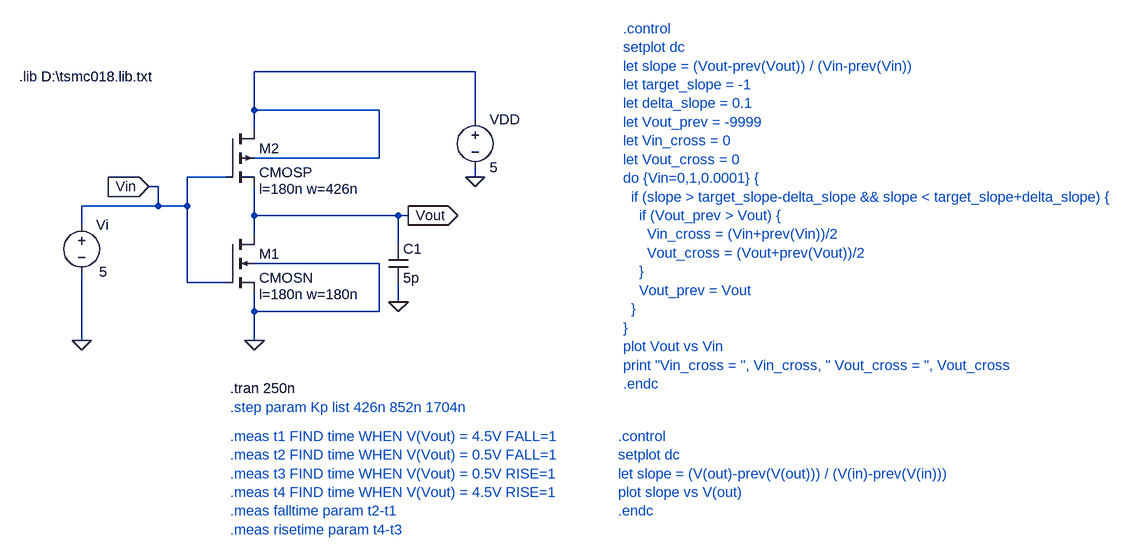
[diagram p0: schematic Project.asc]
Project.asc, the LTspice schematic file:
Version 4
SHEET 1 4604 1200
WIRE 976 128 608 128
WIRE 608 192 608 128
WIRE 816 192 608 192
WIRE 976 208 976 128
WIRE 608 224 608 192
WIRE 816 272 816 192
WIRE 816 272 608 272
WIRE 560 304 496 304
WIRE 976 304 976 288
WIRE 448 320 432 320
WIRE 448 352 448 320
WIRE 448 352 320 352
WIRE 496 352 496 304
WIRE 496 352 448 352
WIRE 608 368 608 320
WIRE 848 368 608 368
WIRE 864 368 848 368
WIRE 320 384 320 352
WIRE 608 400 608 368
WIRE 848 416 848 368
WIRE 816 448 608 448
WIRE 496 480 496 352
WIRE 560 480 496 480
WIRE 848 512 848 480
WIRE 608 528 608 496
WIRE 816 528 816 448
WIRE 816 528 608 528
WIRE 320 576 320 464
WIRE 608 576 608 528
FLAG 608 576 0
FLAG 976 304 0
FLAG 864 368 Vout
IOPIN 864 368 Out
FLAG 432 320 Vin
IOPIN 432 320 In
FLAG 320 576 0
FLAG 848 512 0
SYMBOL nmos4 560 400 R0
WINDOW 123 56 100 Left 2
SYMATTR Value2 l=180n w=180n
SYMATTR InstName M1
SYMATTR Value CMOSN
SYMBOL pmos4 560 224 R0
WINDOW 123 56 100 Left 2
SYMATTR Value2 l=180n w=426n
SYMATTR InstName M2
SYMATTR Value CMOSP
SYMBOL voltage 976 192 R0
WINDOW 123 0 0 Left 0
WINDOW 39 0 0 Left 0
SYMATTR InstName VDD
SYMATTR Value 5
SYMBOL voltage 320 368 R0
WINDOW 3 29 94 Left 2
WINDOW 123 0 0 Left 0
WINDOW 39 0 0 Left 0
SYMATTR Value 5
SYMATTR InstName Vi
SYMBOL cap 832 416 R0
SYMATTR InstName C1
SYMATTR Value 5p
TEXT 216 136 Left 2 !.lib D:\\tsmc018.lib.txt
TEXT 3688 736 Left 2 ;.control\nsetplot dc\nlet slope = (V(out)-prev(V(out))) / (V(in)-prev(V(in)))\nplot slope vs V(out)\n.endc
TEXT 568 736 Left 2 ;.meas t1 FIND time WHEN V(Vout) = 4.5V FALL=1\n.meas t2 FIND time WHEN V(Vout) = 0.5V FALL=1\n.meas t3 FIND time WHEN V(Vout) = 0.5V RISE=1\n.meas t4 FIND time WHEN V(Vout) = 4.5V RISE=1\n.meas falltime param t2-t1\n.meas risetime param t4-t3
TEXT 3696 56 Left 2 ;.control\nsetplot dc\nlet slope = (Vout-prev(Vout)) / (Vin-prev(Vin))\nlet target_slope = -1\nlet delta_slope = 0.1\nlet Vout_prev = -9999\nlet Vin_cross = 0\nlet Vout_cross = 0\ndo {Vin=0,1,0.0001} {\n  if (slope > target_slope-delta_slope && slope < target_slope+delta_slope) {\n    if (Vout_prev > Vout) {\n      Vin_cross = (Vin+prev(Vin))/2\n      Vout_cross = (Vout+prev(Vout))/2\n    }\n    Vout_prev = Vout\n  }\n}\nplot Vout vs Vin\nprint "Vin_cross = ", Vin_cross, " Vout_cross = ", Vout_cross\n.endc
TEXT 568 688 Left 2 ;.step param Kp list 426n 852n 1704n
TEXT 568 656 Left 2 !.tran 250n

The netlist it stands for:
* Project.asc
M1 Vout Vin 0 0 CMOSN l=180n w=180n
M2 N001 Vin Vout N001 CMOSP l=180n w=426n
VDD N001 0 5
Vi Vin 0 5
C1 Vout 0 5p
.model NMOS NMOS
.model PMOS PMOS
.lib standard.mos
.lib D:\tsmc018.lib.txt
* .control
* setplot dc
* let slope = (V(out)-prev(V(out))) / (V(in)-prev(V(in)))
* plot slope vs V(out)
* .endc
* .meas t1 FIND time WHEN V(Vout) = 4.5V FALL=1
* .meas t2 FIND time WHEN V(Vout) = 0.5V FALL=1
* .meas t3 FIND time WHEN V(Vout) = 0.5V RISE=1
* .meas t4 FIND time WHEN V(Vout) = 4.5V RISE=1
* .meas falltime param t2-t1
* .meas risetime param t4-t3
* .control
* setplot dc
* let slope = (Vout-prev(Vout)) / (Vin-prev(Vin))
* let target_slope = -1
* let delta_slope = 0.1
* let Vout_prev = -9999
* let Vin_cross = 0
* let Vout_cross = 0
* do {Vin=0,1,0.0001} {
*   if (slope > target_slope-delta_slope && slope < target_slope+delta_slope) {
*     if (Vout_prev > Vout) {
*       Vin_cross = (Vin+prev(Vin))/2
*       Vout_cross = (Vout+prev(Vout))/2
*     }
*     Vout_prev = Vout
*   }
* }
* plot Vout vs Vin
* print "Vin_cross = ", Vin_cross, " Vout_cross = ", Vout_cross
* .endc
* .step param Kp list 426n 852n 1704n
.tran 250n
.backanno
.end